# Altium schematic sheet Copy of ST_LINK_V2-1.SCHDOC: STLINK/V2-1
size A4; DocumentNumber: MB1180; Revision: C.1; SheetNumber: 3; SheetTotal: 3; Project: NUCLEO32
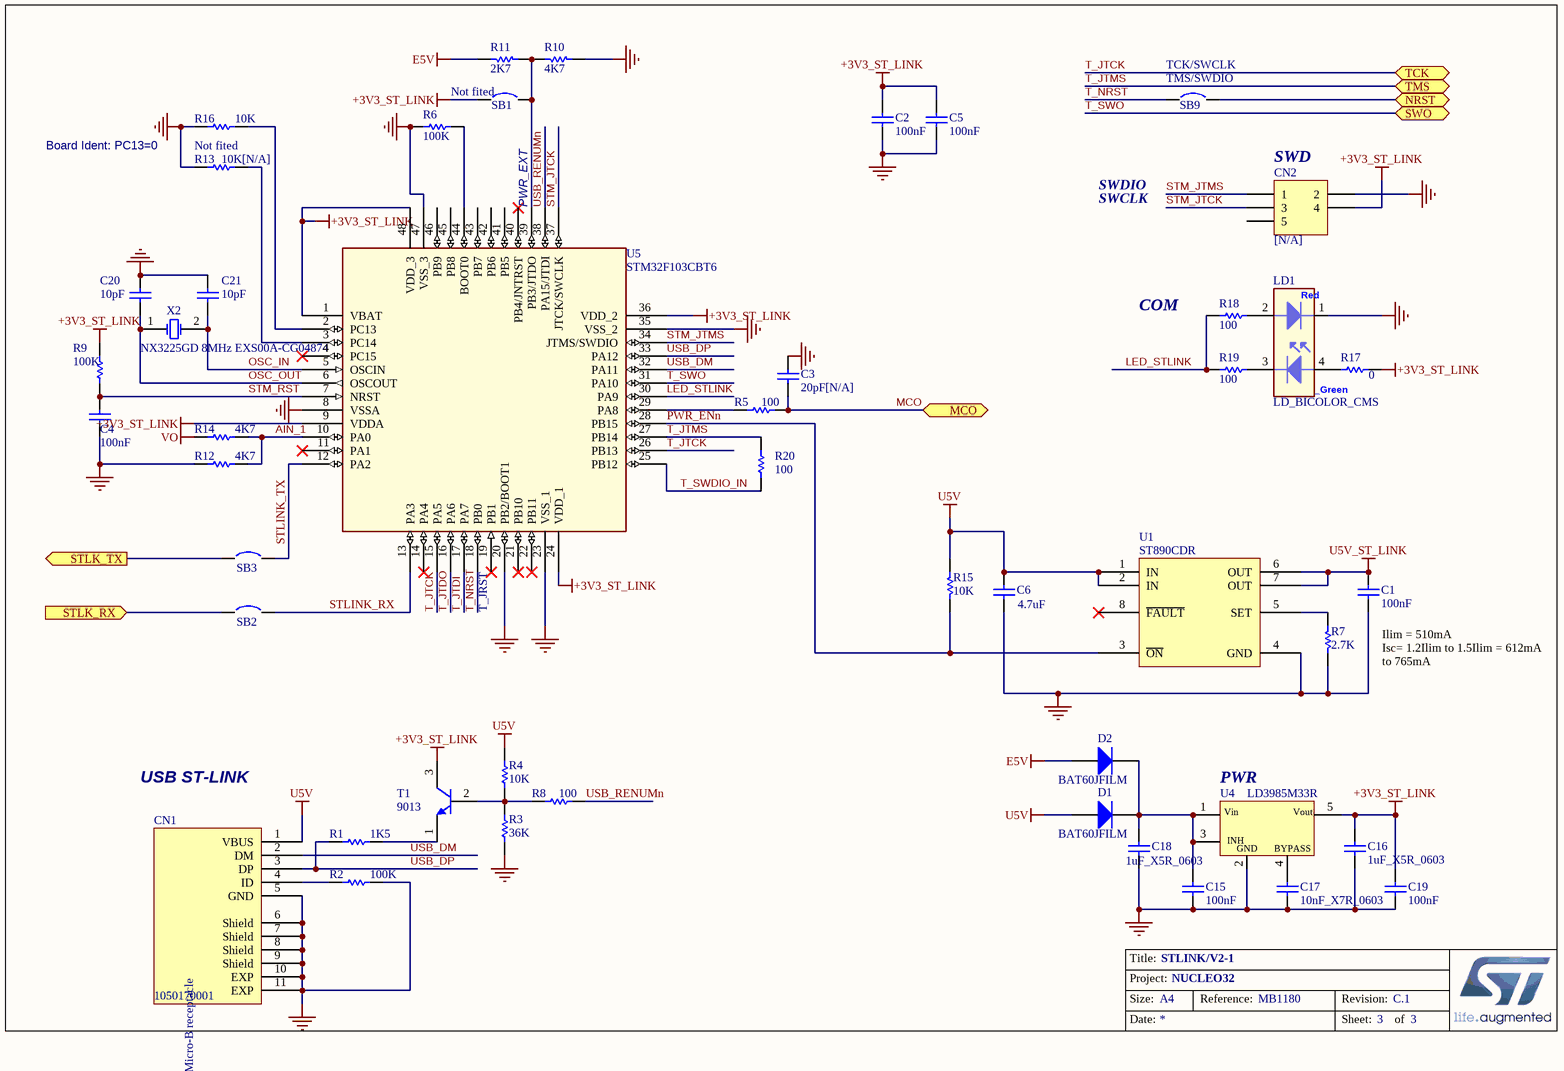
[diagram p0: Copy of ST_LINK_V2-1.SCHDOC]

## Parts
C1  100nF  [0603C]
C2  100nF  [0603C]
C3  20pF[N/A]  [0603C]
C4  100nF  [0603C]
C5  100nF  [0603C]
C6  4.7uF  [0603C]
C15  100nF  [0603C]
C16  1uF_X5R_0603  [0603C]
C17  10nF_X7R_0603  [0603C]
C18  1uF_X5R_0603  [0603C]
C19  100nF  [0603C]
C20  10pF  [0603C]
C21  10pF  [0603C]
CN1  1050170001  [Molex_1050170001]
CN2  [N/A]  [HDR_1x5_2R54_V_M]
D1  BAT60JFILM  [SOD-323]
D2  BAT60JFILM  [SOD-323]
LD1  LD_BICOLOR_CMS  [HSMF-A201]
R1  1K5  [0603R]
R2  100K  [0603R]
R3  36K  [0603R]
R4  10K  [0603R]
R5  100  [0603R]
R6  100K  [0603R]
R7  2.7K  [0603R]
R8  100  [0603R]
R9  100K  [0603R]
R10  4K7  [0603R]
R11  2K7  [0603R]
R12  4K7  [0603R]
R13  10K[N/A]  [0603R]
R14  4K7  [0603R]
R15  10K  [0603R]
R16  10K  [0603R]
R17  0  [0603R]
R18  100  [0603R]
R19  100  [0603R]
R20  100  [0603R]
SB1  Circuit Breaker (open)  [SB_0603]  (value not drawn)
SB2  Circuit Breaker (close)  [SB_0603]  (value not drawn)
SB3  Circuit Breaker (close)  [SB_0603]  (value not drawn)
SB9  Circuit Breaker (close)  [SB_0603]  (value not drawn)
T1  9013  [SOT23-3]
U1  ST890CDR  [SO-8]
U4  LD3985M33R  [SOT23-5L]
U5  STM32F103CBT6  [LQFP48_0R5_7x7]
X2  NX3225GD 8MHz EXS00A-CG04874  [XTAL_2SM_3R2x2R5]

## Ports
MCO, NRST, STLK_RX (in), STLK_TX (out), SWO, TCK, TMS

## Nets
+3V3_ST_LINK: C2.2 C5.2 C16.1 C19.2 CN2.4 R9.2 R17.2 SB1.1 T1.3(C) U4.5(Vout) U5.1(VBAT) U5.9(VDDA) U5.24(VDD_1) U5.36(VDD_2) U5.48(VDD_3)
E5V: D2.1(A) R11.1
GND: C1.1 C2.1 C3.2 C4.1 C5.1 C6.1 C15.1 C16.2 C17.1 C18.1 C19.1 C20.2 C21.2 CN1.5(GND) CN1.6(Shield) CN1.7(Shield) CN1.8(Shield) CN1.9(Shield) CN1.10(EXP) CN1.11(EXP) CN2.2 LD1.1 R2.2 R3.1 R6.1 R7.2 R10.2 R12.1 R13.1 R16.1 U1.4(GND) U4.2(GND) U5.8(VSSA) U5.20(PB2/BOOT1) U5.23(VSS_1) U5.35(VSS_2) U5.47(VSS_3)
U5V: C6.2 CN1.1(VBUS) D1.1(A) R4.2 R15.1 U1.1(IN) U1.2(IN)
U5V_ST_LINK: C1.2 U1.6(OUT) U1.7(OUT)
VO: R14.1
AIN_1: R12.2 R14.2 U5.10(PA0)
LED_STLINK: R18.1 R19.1 U5.30(PA9)
MCO: C3.1 R5.2 ; port MCO
NRST: SB9.2 ; port NRST
OSC_IN: C21.1 U5.5(OSCIN) X2.2(OSC2)
OSC_OUT: C20.1 U5.6(OSCOUT) X2.1(OSC1)
PWR_ENn: R15.2 U1.3(~{ON}) U5.28(PB15)
STLINK_RX: SB2.2 U5.13(PA3)
STLINK_TX: SB3.2 U5.12(PA2)
STLK_RX: SB2.1 ; port STLK_RX
STLK_TX: SB3.1 ; port STLK_TX
STM_JTCK: CN2.3 U5.37(JTCK/SWCLK)
STM_JTMS: CN2.1 U5.34(JTMS/SWDIO)
STM_RST: C4.2 R9.1 U5.7(NRST)
T_JTCK: U5.15(PA5) U5.26(PB13) ; port TCK
T_JTDI: U5.17(PA7)
T_JTDO: U5.16(PA6)
T_JTMS: R20.2 U5.27(PB14) ; port TMS
T_NRST: SB9.1 U5.18(PB0)
T_SWDIO_IN: R20.1 U5.25(PB12)
T_SWO: U5.31(PA10) ; port SWO
USB_DM: CN1.2(DM) U5.32(PA11)
USB_DP: CN1.3(DP) R1.1 U5.33(PA12)
USB_RENUMn: R8.2 U5.38(PA15/JTDI)
NetC15_2: C15.2 C18.2 D1.2(K) D2.2(K) U4.1(Vin) U4.3(CE)
NetC17_2: C17.2 U4.4(BYPASS)
NetCN1_4: CN1.4(ID) R2.1
NetLD1_2: LD1.2 R18.2
NetLD1_3: LD1.3 R19.2
NetLD1_4: LD1.4 R17.1
NetR1_2: R1.2 T1.1(E)
NetR3_2: R3.2 R4.1 R8.1 T1.2(B)
NetR5_1: R5.1 U5.29(PA8)
NetR6_2: R6.2 U5.44(BOOT0)
NetR7_1: R7.1 U1.5(SET)
NetR10_1: R10.1 R11.2 SB1.2 U5.39(PB3/JTDO)
NetR13_2: R13.2 U5.3(PC14)
NetR16_2: R16.2 U5.2(PC13)

Not connected (* = marked no-connect by the designer): CN2 5; U1 8(~{FAULT})*; U5 4(PC15)* 11(PA1)* 14(PA4)* 19(PB1)* 21(PB10)* 22(PB11)* 40(PB4/JNTRST)* 41(PB5) 42(PB6) 43(PB7) 45(PB8) 46(PB9)

## Notes on the sheet
- (near SB1) Not fited
- (near SB9) TCK/SWCLK
- (near SB9) TMS/SWDIO
- Board Ident: PC13=0
- Not fited
- (near CN2) SWD
- (near U5) PWR_EXT
- SWCLK
- SWDIO
- COM
- (near U5) T_JRST
- (near C1) Ilim = 510mA
  Isc= 1.2Ilim to 1.5Ilim = 612mA to 765mA
- USB ST-LINK
- (near U4) PWR
- Title:
- Project:
- Size:
- Date:
- A4
- Reference:
- Sheet:
- Revision:
- of
- (in symbol 1050170001) USB_Micro-B receptacle
- (in symbol LD3985M33R) INH
- (in symbol LD_BICOLOR_CMS) Red; _Green

## Library data of the parts
C1 C2 C4 C5 C15 C19 = Capacitor_ST: Capacitor 0402 / 0603 / 0805; Revision: July-2002: Re-released for DXP Platform.; Value: 100nF
C3 C20 C21 = Capacitor_ST: Capacitor 0402 / 0603 / 0805; Value: 100nF; Revision: July-2002: Re-released for DXP Platform.
C6 C16 C18 = CAP SMD 0603  X5R 1µF 25V 10%: 0603  X5R 1µF; Rated voltage: 25V; Tolerance: 10%; Manufacturer: *; Manufacturer P/N: *; Order code Farnell: 1288202RL; Value: 1µF; Power: *; Technology: X5R; Temperature  Factor: *; Temperature Max: +125°C; Temperature Min: -55°C; STS Code: *
C17 = CAP SMD 0603  X7R 10000PF 50V 10%: 0603  X7R 10NF; Order code RS: 2040779; Rated voltage: 50V; Tolerance: 10%; Order code Farnell: 7569548RL; Value: 10NF; Power: *; Technology: X7R; Temperature Factor: *; Temperature Min: -55°C; Temperature Max: +125°C; STS Code: *
CN1 = 1050170001: Silkscreen: USB
CN2 = Header 3X2: Header, 3-Pin, Dual row; Revision: 17-Jul-2002: Re-released for DXP Platform.; Publisher: Altium Limited
D1 D2 = BAT60JFILM: Manuf_1: STM; Provided: ST; ECCN_US/EU: EAR99/NEC; Revision: July-2002: Re-released for DXP Platform.; Order: BAT60JFILM; Manuf_Part_1: BAT60JFILM; Distrib: ST
LD1 = LD_BICOLOR_CMS: Bicolor Led; Manuf_Part_1: HSMF-A201-A00J1; Manuf_1: Avago Technologies; Ref St: xxxxxx; cap_dec: ----; Distrib: RADIOSPARES
R1 R2 R5 R6 R8 R9 R17-R20 = Resistor_ST: Resistor 0402 / 0603 / 0805; Value: 10K
R3 R4 R10 R11 = Res1: Resistor; Value: 1K; Published: 8-Jun-2000; Revision: July-2002: Re-released for DXP Platform.; Publisher: Altium Limited
R7 R15 = Res1: Resistor; Value: 1K; Ordered by: Subcon; Published: 8-Jun-2000; Revision: July-2002: Re-released for DXP Platform.; Publisher: Altium Limited
R12-R14 = Resistor_ST: Resistor 0402 / 0603 / 0805; Value: 10K; Fitted: NO
R16 = Resistor_ST: Resistor 0402 / 0603 / 0805; Value: 10K
SB1-SB3 SB9 = Circuit Breaker: Solder: NO; Published: 24-Mar-1999; Revision: July-2002: Re-released for DXP Platform.; Publisher: Altium Limited
T1 = NPN: NPN Bipolar Transistor; Code - JEDEC: TO-226-AA; Published: 8-Jun-2000; Revision: July-2002: Re-released for DXP Platform.; Publisher: Altium Limited
U4 = LD3985M33R: Ultra low drop-low noise BiCMOS voltage, regulators low ESR capacitors compatible; Manuf_1: STM; Provided: ST; Ref St: 9176161; ECCN_US/EU: EAR99/NEC; Manuf_Part_1: LD3985M33R; Distrib: ST; Order: LD3985M33R
U5 = STM32F103CBT6: Medium-density performance line ARM-based 32-bit MCU with 64KB Flash; Manuf_Part_1: STM32F103C8T6; Manuf_1: STM; Ref St: 9175981; Provided: ST; ECCN_US/EU: 3A991A2/NEC; Footprint: QFP48 7X7; Distrib: ST; Order: STM32F103C8T6
X2 = XTAL: Crystal Oscillator; Published: 8-Jun-2000; LatestRevisionDate: 17-Jul-2002; LatestRevisionNote: Re-released for DXP Platform.; PackageReference: R38; Publisher: Altium Limited